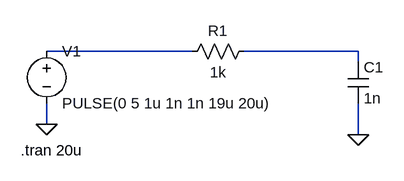
[diagram p0: schematic quiz_q5.asc]
quiz_q5.asc, the LTspice schematic file:
Version 4
SHEET 1 880 680
WIRE 352 80 128 80
WIRE 608 80 432 80
WIRE 608 96 608 80
WIRE 128 192 128 160
WIRE 608 208 608 160
FLAG 128 192 0
FLAG 608 208 0
SYMBOL voltage 128 64 R0
WINDOW 123 0 0 Left 0
WINDOW 39 0 0 Left 0
SYMATTR InstName V1
SYMATTR Value PULSE(0 5 1u 1n 1n 19u 20u)
SYMBOL res 448 64 R90
WINDOW 0 0 56 VBottom 2
WINDOW 3 32 56 VTop 2
SYMATTR InstName R1
SYMATTR Value 1k
SYMBOL cap 592 96 R0
SYMATTR InstName C1
SYMATTR Value 1n
TEXT 88 232 Left 2 !.tran 20u

The netlist it stands for:
* quiz_q5.asc
V1 N001 0 PULSE(0 5 1u 1n 1n 19u 20u)
R1 N002 N001 1k
C1 N002 0 1n
.tran 20u
.backanno
.end